# Altium project slaves.PrjPCB
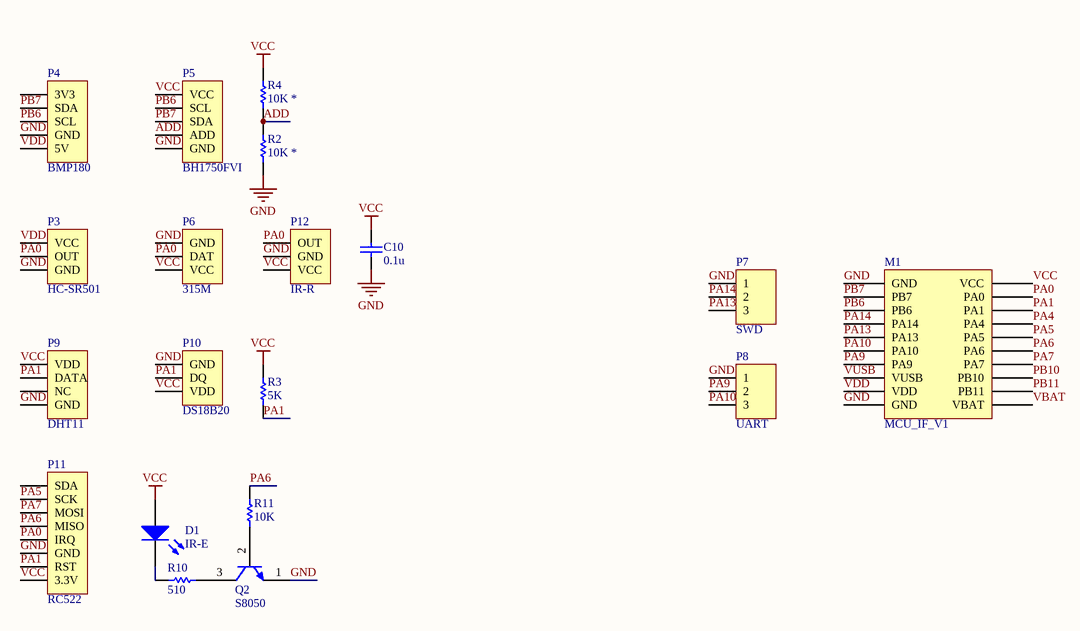
[diagram p0: sensors.SchDoc]
3 sheets, 40 parts. Net scope: global (net labels, ports and power ports of the same name join across sheets).
Board file: relay.PcbDoc
Sheets:
  sensors.SchDoc
  relay.SchDoc
  IR.SchDoc

## Sheet sensors.SchDoc
size A4

### Parts
C10  value 0.1u  [C-1608[0603]]  (hidden comment: Cap Semi)
D1  IR-E  [PIN2]
M1  MCU_IF_V1  [MCU_IF_V1]
P3  HC-SR501  [HDR1X3]
P4  BMP180  [HDR1X5]
P5  BH1750FVI  [HDR1X5]
P6  315M  [HDR1X3]
P7  SWD  [HDR1X3]
P8  UART  [HDR1X3]
P9  DHT11  [HDR1X4]
P10  DS18B20  [HDR1X3]
P11  RC522  [HDR1X8]
P12  IR-R  [HDR1X3]
Q2  S8050  [SOT23B]
R2  value 10K *  [R-1608[0603]]  (hidden comment: Res Semi)
R3  value 5K  [R-1608[0603]]  (hidden comment: Res Semi)
R4  value 10K *  [R-1608[0603]]  (hidden comment: Res Semi)
R10  value 510  [R-1608[0603]]  (hidden comment: Res Semi)
R11  value 10K  [R-1608[0603]]  (hidden comment: Res Semi)

### Nets
GND: C10.1 M1.1(GND) M1.10(GND) P3.3(GND) P4.4(GND) P5.5(GND) P6.1(GND) P7.1 P8.1 P9.4(GND) P10.1(GND) P11.6(GND) P12.2(GND) Q2.1(E) R2.2
VCC: C10.2 D1.1(A) M1.20(VCC) P5.1(VCC) P6.3(VCC) P9.1(VDD) P10.3(VDD) P11.8(3.3V) P12.3(VCC) R3.1 R4.1
VDD: M1.9(VDD) P3.1(VCC) P4.5(5V)
ADD: P5.4(ADD) R2.1 R4.2
PA0: M1.19(PA0) P3.2(OUT) P6.2(DAT) P11.5(IRQ) P12.1(OUT)
PA1: M1.18(PA1) P9.2(DATA) P10.2(DQ) P11.7(RST) R3.2
PA4: M1.17(PA4)
PA5: M1.16(PA5) P11.2(SCK)
PA6: M1.15(PA6) P11.4(MISO) R11.2
PA7: M1.14(PA7) P11.3(MOSI)
PA9: M1.7(PA9) P8.2
PA10: M1.6(PA10) P8.3
PA13: M1.5(PA13) P7.3
PA14: M1.4(PA14) P7.2
PB6: M1.3(PB6) P4.3(SCL) P5.2(SCL)
PB7: M1.2(PB7) P4.2(SDA) P5.3(SDA)
PB10: M1.13(PB10)
PB11: M1.12(PB11)
VBAT: M1.11(VBAT)
VUSB: M1.8(VUSB)
NetD1_2: D1.2(K) R10.1
NetQ2_2: Q2.2(B) R11.1
NetQ2_3: Q2.3(C) R10.2

Not connected (* = marked no-connect by the designer): P4 1(3V3); P9 3(NC); P11 1(SDA)

### Library data of the parts
C10 = Cap Semi: Capacitor (Semiconductor SIM Model); Published: 8-Jun-2000; LatestRevisionDate: 17-Jul-2002; LatestRevisionNote: Re-released for DXP Platform.; PackageReference: C1206; Publisher: Altium Limited
D1 = LED0: Typical INFRARED GaAs LED; Published: 8-Jun-2000; LatestRevisionDate: 08-Jul-2005; LatestRevisionNote: Mech Layer 1 removed.; PackageReference: LED-0; Publisher: Altium Limited
P3 = HC-SR501: Header, 3-Pin; LatestRevisionDate: 17-Jul-2002; LatestRevisionNote: Re-released for DXP Platform.; Publisher: Altium Limited
P4 = BMP180: Header, 5-Pin; LatestRevisionDate: 17-Jul-2002; LatestRevisionNote: Re-released for DXP Platform.; Publisher: Altium Limited
P6 = 315M: Header, 3-Pin; LatestRevisionDate: 17-Jul-2002; LatestRevisionNote: Re-released for DXP Platform.; Publisher: Altium Limited
P7 P8 = Header 3: Header, 3-Pin; LatestRevisionDate: 17-Jul-2002; LatestRevisionNote: Re-released for DXP Platform.; Publisher: Altium Limited
P9 = DHT11: Header, 4-Pin; LatestRevisionDate: 17-Jul-2002; LatestRevisionNote: Re-released for DXP Platform.; Publisher: Altium Limited
P10 = DS18B20: Header, 3-Pin; LatestRevisionDate: 17-Jul-2002; LatestRevisionNote: Re-released for DXP Platform.; Publisher: Altium Limited
P11 = RC522: Header, 8-Pin; LatestRevisionDate: 17-Jul-2002; LatestRevisionNote: Re-released for DXP Platform.; Publisher: Altium Limited
P12 = IR: Header, 3-Pin; LatestRevisionDate: 17-Jul-2002; LatestRevisionNote: Re-released for DXP Platform.; Publisher: Altium Limited
Q2 = 2N3904: NPN General Purpose Amplifier; pin to pad: 1>2 2>1; Published: 8-Jun-2000; LatestRevisionDate: 15-Jan-2003; LatestRevisionNote: PCB Footprint 'BCY-W3/D4.7' replaced; DatasheetDocument: 1997; PackageDocument: Sep-1998; PackageReference: TO-92A; Publisher: Altium Limited; Code_JEDEC: TO-92A; ComponentLink1Description: Manufacturer Link; ComponentLink1URL: http://www.fairchildsemi.com/; ComponentLink2Description: Datasheet; ComponentLink2URL: http://www.fairchildsemi.com/ds/2N%2F2N3904.pdf
R2-R4 R10 R11 = Res Semi: Semiconductor Resistor; Published: 8-Jun-2000; LatestRevisionDate: 17-Jul-2002; LatestRevisionNote: Re-released for DXP Platform.; PackageReference: AXIAL-0.5; Publisher: Altium Limited
P5 = BH1750FVI: LatestRevisionDate: 17-Jul-2002; LatestRevisionNote: Re-released for DXP Platform.; Publisher: Altium Limited

## Sheet relay.SchDoc
size A4
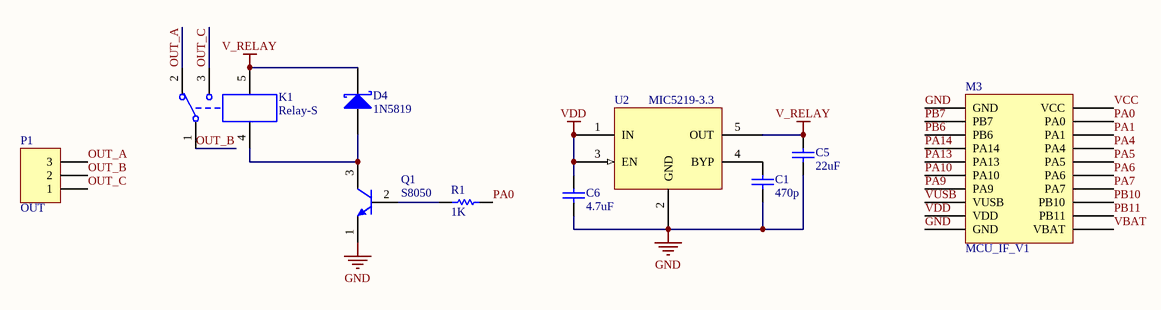
[diagram p1: relay.SchDoc]

### Parts
C1  value 470p  [C-1608[0603]]  (hidden comment: Cap Semi)
C5  value 22uF  [C-2012[0805]]  (hidden comment: Cap Semi)
C6  value 4.7uF  [C-1608[0603]]  (hidden comment: Cap Semi)
D4  1N5819  [SOD123]
K1  Relay-S  [Relay-JZC-32F-ZS]
M3  MCU_IF_V1  [MCU_IF_V1]
P1  OUT  [Edge5.08mm3P]
Q1  S8050  [SOT23B]
R1  value 1K  [R-1608[0603]]  (hidden comment: Res Semi)
U2  MIC5219-3.3  [SOT23-5]

### Nets
GND: C1.2 C5.2 C6.2 M3.1(GND) M3.10(GND) Q1.1(E) U2.2(GND)
V_RELAY: C5.1 D4.2(K) K1.5 U2.5(OUT)
VCC: M3.20(VCC)
VDD: C6.1 M3.9(VDD) U2.1(IN) U2.3(EN)
OUT_A: K1.2 P1.3
OUT_B: K1.1 P1.2
OUT_C: K1.3 P1.1
PA0: M3.19(PA0) R1.2
PA1: M3.18(PA1)
PA4: M3.17(PA4)
PA5: M3.16(PA5)
PA6: M3.15(PA6)
PA7: M3.14(PA7)
PA9: M3.7(PA9)
PA10: M3.6(PA10)
PA13: M3.5(PA13)
PA14: M3.4(PA14)
PB6: M3.3(PB6)
PB7: M3.2(PB7)
PB10: M3.13(PB10)
PB11: M3.12(PB11)
VBAT: M3.11(VBAT)
VUSB: M3.8(VUSB)
NetC1_1: C1.1 U2.4(BYP)
NetD4_1: D4.1(A) K1.4 Q1.3(C)
NetQ1_2: Q1.2(B) R1.1

### Library data of the parts
C1 C5 C6 = Cap Semi: Capacitor (Semiconductor SIM Model); Published: 8-Jun-2000; LatestRevisionDate: 29-May-2009; LatestRevisionNote: IPC-7351 Footprint Added.; PackageReference: C1206; Publisher: Altium Limited; PackageDescription: Chip Capacitor
D4 = D Schottky: Schottky Diode; Published: 8-Jun-2000; LatestRevisionDate: 17-Jul-2002; LatestRevisionNote: Re-released for DXP Platform.; Publisher: Altium Limited
K1 = Relay-SPDT: Single-Pole Dual-Throw Relay; Published: 24-Mar-1999; LatestRevisionDate: 17-Jul-2002; LatestRevisionNote: Re-released for DXP Platform.; PackageReference: MODULE5B; Publisher: Altium Limited
P1 = Header 3: Header, 3-Pin; LatestRevisionDate: 17-Jul-2002; LatestRevisionNote: Re-released for DXP Platform.; Publisher: Altium Limited
Q1 = 2N3904: NPN General Purpose Amplifier; pin to pad: 1>2 2>1; Published: 8-Jun-2000; LatestRevisionDate: 15-Jan-2003; LatestRevisionNote: PCB Footprint 'BCY-W3/D4.7' replaced; DatasheetDocument: 1997; PackageDocument: Sep-1998; PackageReference: TO-92A; Publisher: Altium Limited; Code_JEDEC: TO-92A; ComponentLink1Description: Manufacturer Link; ComponentLink1URL: http://www.fairchildsemi.com/; ComponentLink2Description: Datasheet; ComponentLink2URL: http://www.fairchildsemi.com/ds/2N%2F2N3904.pdf
R1 = Res Semi: Semiconductor Resistor; Published: 8-Jun-2000; LatestRevisionDate: 17-Jul-2002; LatestRevisionNote: Re-released for DXP Platform.; PackageReference: AXIAL-0.5; Publisher: Altium Limited
U2 = MIC5219: 500mA-Peak Output LDO Regulator

## Sheet IR.SchDoc
size A4
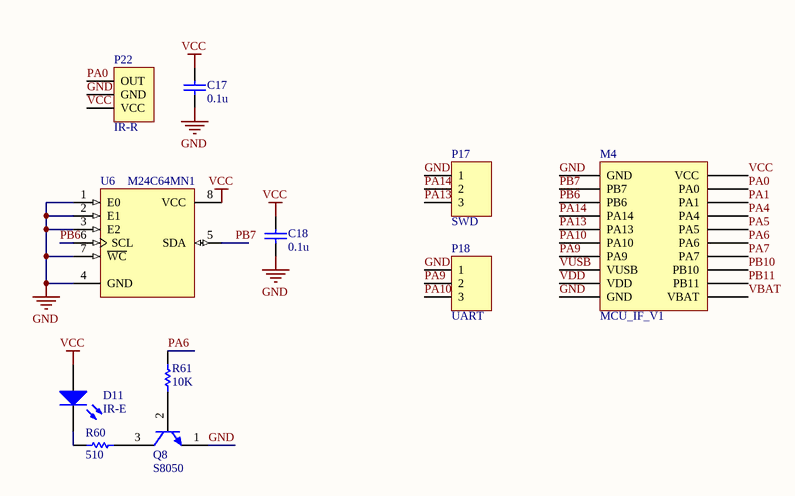
[diagram p2: IR.SchDoc]

### Parts
C17  value 0.1u  [C-1608[0603]]  (hidden comment: Cap Semi)
C18  value 0.1u  [C-1608[0603]]  (hidden comment: Cap Semi)
D11  IR-E  [PIN2]
M4  MCU_IF_V1  [MCU_IF_V1]
P17  SWD  [HDR1X3]
P18  UART  [HDR1X3]
P22  IR-R  [HDR1X3]
Q8  S8050  [SOT23B]
R60  value 510  [R-1608[0603]]  (hidden comment: Res Semi)
R61  value 10K  [R-1608[0603]]  (hidden comment: Res Semi)
U6  M24C64MN1  [SOP8_N]

### Nets
GND: C17.1 C18.1 M4.1(GND) M4.10(GND) P17.1 P18.1 P22.2(GND) Q8.1(E) U6.1(E0) U6.2(E1) U6.3(E2) U6.4(GND) U6.7(~{WC})
VCC: C17.2 C18.2 D11.1(A) M4.20(VCC) P22.3(VCC) U6.8(VCC)
VDD: M4.9(VDD)
PA0: M4.19(PA0) P22.1(OUT)
PA1: M4.18(PA1)
PA4: M4.17(PA4)
PA5: M4.16(PA5)
PA6: M4.15(PA6) R61.2
PA7: M4.14(PA7)
PA9: M4.7(PA9) P18.2
PA10: M4.6(PA10) P18.3
PA13: M4.5(PA13) P17.3
PA14: M4.4(PA14) P17.2
PB6: M4.3(PB6) U6.6(SCL)
PB7: M4.2(PB7) U6.5(SDA)
PB10: M4.13(PB10)
PB11: M4.12(PB11)
VBAT: M4.11(VBAT)
VUSB: M4.8(VUSB)
NetD11_2: D11.2(K) R60.1
NetQ8_2: Q8.2(B) R61.1
NetQ8_3: Q8.3(C) R60.2

### Library data of the parts
C17 C18 = Cap Semi: Capacitor (Semiconductor SIM Model); Published: 8-Jun-2000; LatestRevisionDate: 17-Jul-2002; LatestRevisionNote: Re-released for DXP Platform.; PackageReference: C1206; Publisher: Altium Limited
D11 = LED0: Typical INFRARED GaAs LED; Published: 8-Jun-2000; LatestRevisionDate: 08-Jul-2005; LatestRevisionNote: Mech Layer 1 removed.; PackageReference: LED-0; Publisher: Altium Limited
P17 P18 = Header 3: Header, 3-Pin; LatestRevisionDate: 17-Jul-2002; LatestRevisionNote: Re-released for DXP Platform.; Publisher: Altium Limited
P22 = IR: Header, 3-Pin; LatestRevisionDate: 17-Jul-2002; LatestRevisionNote: Re-released for DXP Platform.; Publisher: Altium Limited
Q8 = 2N3904: NPN General Purpose Amplifier; pin to pad: 1>2 2>1; Published: 8-Jun-2000; LatestRevisionDate: 15-Jan-2003; LatestRevisionNote: PCB Footprint 'BCY-W3/D4.7' replaced; DatasheetDocument: 1997; PackageDocument: Sep-1998; PackageReference: TO-92A; Publisher: Altium Limited; Code_JEDEC: TO-92A; ComponentLink1Description: Manufacturer Link; ComponentLink1URL: http://www.fairchildsemi.com/; ComponentLink2Description: Datasheet; ComponentLink2URL: http://www.fairchildsemi.com/ds/2N%2F2N3904.pdf
R60 R61 = Res Semi: Semiconductor Resistor; Published: 8-Jun-2000; LatestRevisionDate: 17-Jul-2002; LatestRevisionNote: Re-released for DXP Platform.; PackageReference: AXIAL-0.5; Publisher: Altium Limited
U6 = M24C64MN1: 64 Kbit Serial I²C Bus EEPROM; Published: 24-Aug-2001; LatestRevisionDate: 13-Apr-2006; LatestRevisionNote: IPC-7351 Footprint Added.; DatasheetVersion: Jul-1999; PackageVersion: Jul-1999; PackageReference: SOP8; Publisher: Altium Limited; PackageDescription: 8-Pin Small Outline Integrated Circuit 1.27 mm Pitch; ComponentLink1Description: Manufacturer Link; ComponentLink1URL: http://www.st.com/; ComponentLink2Description: Datasheet; ComponentLink2URL: http://www.st.com/stonline/products/literature/ds/4578/m24c32-w.pdf

## Nets that join several sheets
GND: sensors (15 pins), relay (7 pins), IR (13 pins)
VCC: sensors (11 pins), relay (M3.20), IR (6 pins)
VDD: sensors (M1.9 P3.1 P4.5), relay (C6.1 M3.9 U2.1 U2.3), IR (M4.9)
PA0: sensors (5 pins), relay (M3.19 R1.2), IR (M4.19 P22.1)
PA1: sensors (5 pins), relay (M3.18), IR (M4.18)
PA4: sensors (M1.17), relay (M3.17), IR (M4.17)
PA5: sensors (M1.16 P11.2), relay (M3.16), IR (M4.16)
PA6: sensors (M1.15 P11.4 R11.2), relay (M3.15), IR (M4.15 R61.2)
PA7: sensors (M1.14 P11.3), relay (M3.14), IR (M4.14)
PA9: sensors (M1.7 P8.2), relay (M3.7), IR (M4.7 P18.2)
PA10: sensors (M1.6 P8.3), relay (M3.6), IR (M4.6 P18.3)
PA13: sensors (M1.5 P7.3), relay (M3.5), IR (M4.5 P17.3)
PA14: sensors (M1.4 P7.2), relay (M3.4), IR (M4.4 P17.2)
PB6: sensors (M1.3 P4.3 P5.2), relay (M3.3), IR (M4.3 U6.6)
PB7: sensors (M1.2 P4.2 P5.3), relay (M3.2), IR (M4.2 U6.5)
PB10: sensors (M1.13), relay (M3.13), IR (M4.13)
PB11: sensors (M1.12), relay (M3.12), IR (M4.12)
VBAT: sensors (M1.11), relay (M3.11), IR (M4.11)
VUSB: sensors (M1.8), relay (M3.8), IR (M4.8)